# EAGLE design DC_UPS (EAGLE 5.06)
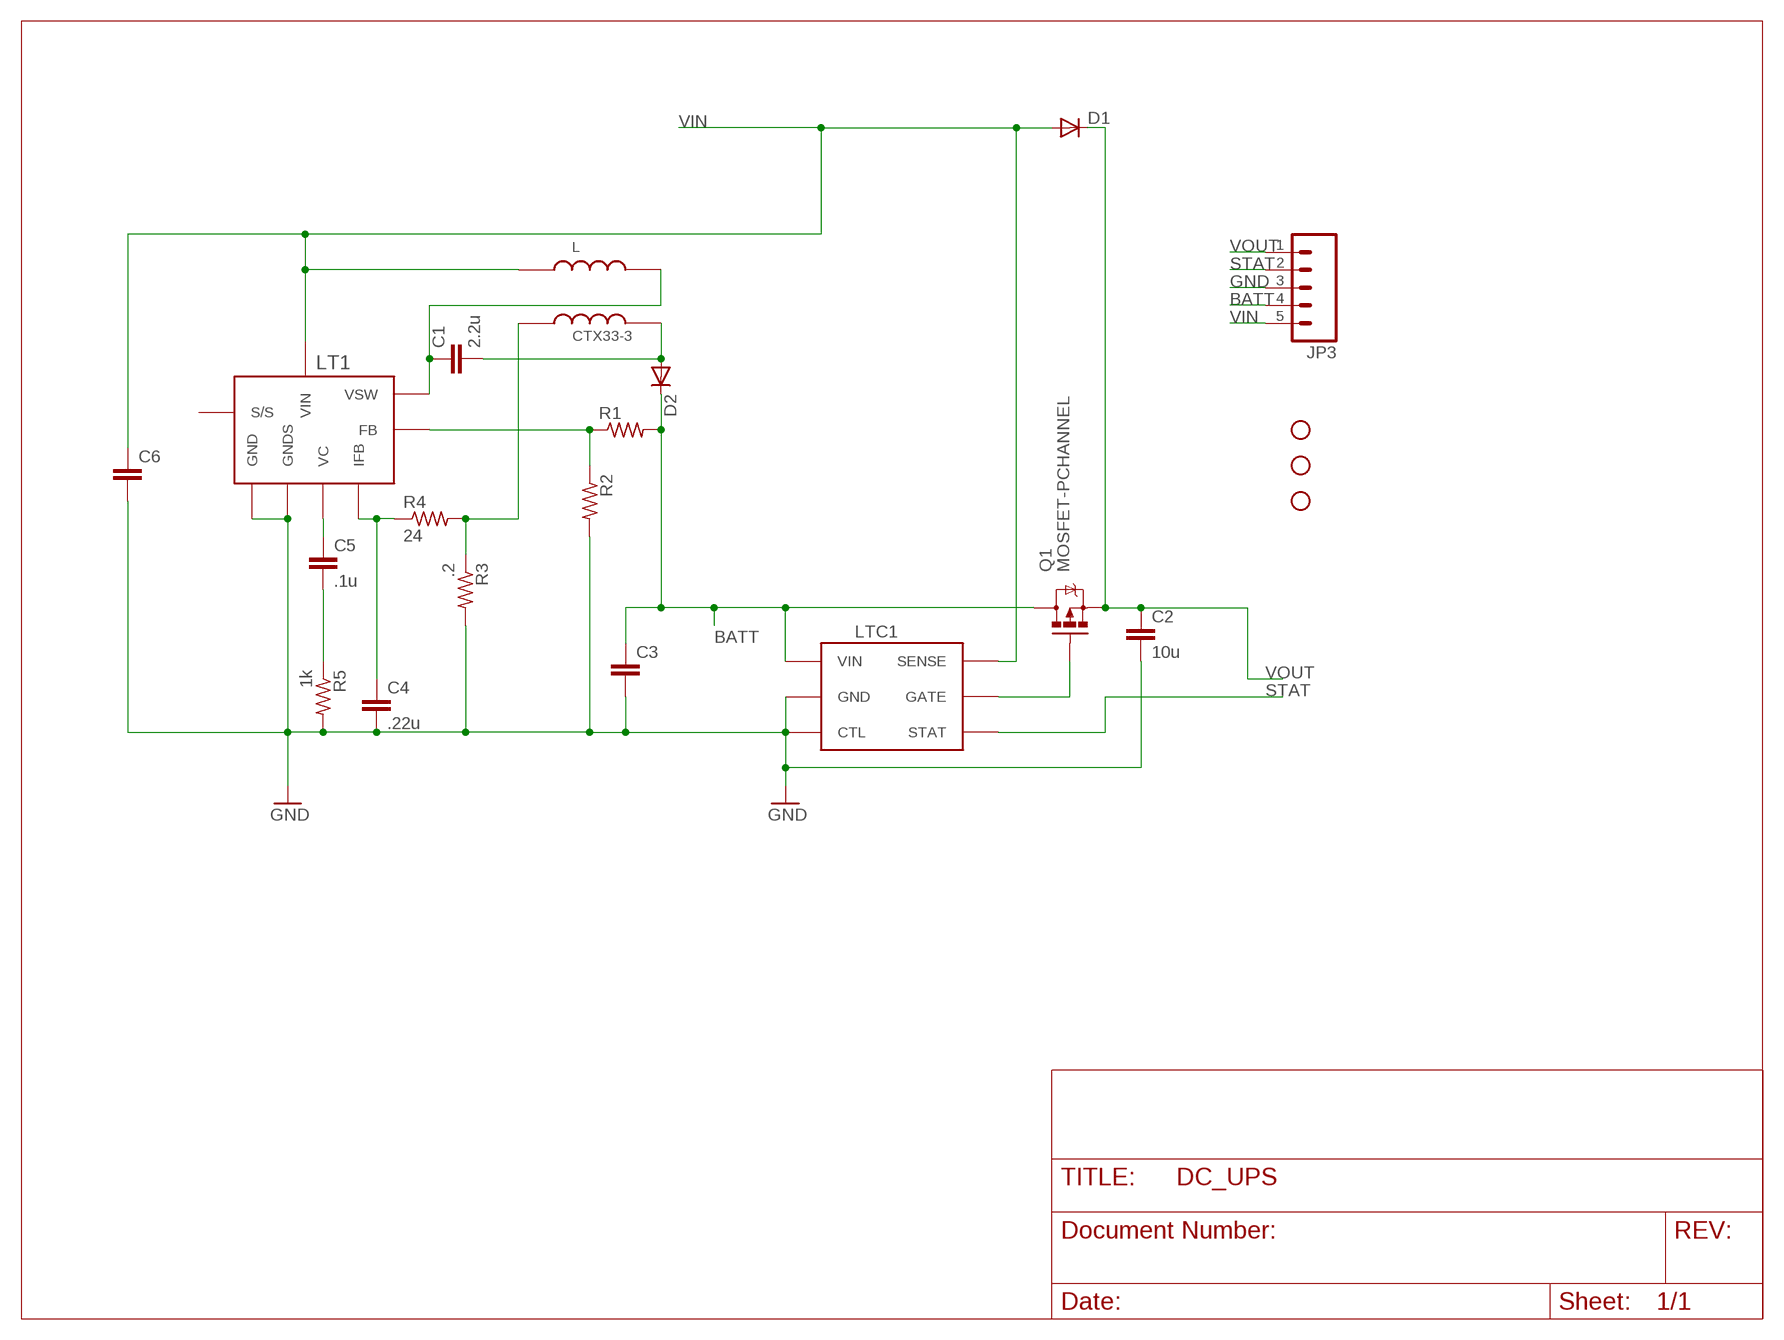
[diagram p0: schematic, sheet 1]

## Parts
C1  2.2u  CAP1206  [C1206]
C2  10u  CAP1210  [C1210]
C3  CAP1206  [C1206]
C4  .22u  CAP1206  [C1206]
C5  .1u  CAP1206  [C1206]
C6  CAP1206  [C1206]
D1  DIODESMA  [SMA-DIODE]
D2  DIODESMA  [SMA-DIODE]
JP1  STAND-OFF  [STAND-OFF]
JP2  STAND-OFF  [STAND-OFF]
JP3  M05PTH  [1X05]
JP4  STAND-OFF  [STAND-OFF]
L  CTX33-3  [CTX33-3]
LT1  LT1512  [SO08]
LTC1  LTC4412  [TSOT23-6]
Q1  MOSFET-PCHANNEL  [SOT23]
R1  R-US_R1206  [R1206]
R2  R-US_R1206  [R1206]
R3  .2  R-US_R1206  [R1206]
R4  24  R-US_R1206  [R1206]
R5  1k  R-US_R1206  [R1206]

## Nets
BATT: C3.1 D2.C JP3.4 LTC1.P$1(VIN) Q1.3(D) R1.2
GND: C2.2 C3.2 C4.2 C6.2 JP3.3 LT1.6(GNDS) LT1.7(GND) LTC1.P$2(GND) LTC1.P$3(CTL) R2.2 R3.2 R5.2
N$1: LTC1.P$5(GATE) Q1.1(G)
N$4: C1.1 L.P$3 LT1.8(VSW)
N$5: C5.1 LT1.1(VC)
N$6: C5.2 R5.1
N$7: C4.1 LT1.3(IFB) R4.1
N$8: L.P$2 R3.1 R4.2
N$9: C1.2 D2.A L.P$4
N$12: LT1.2(FB) R1.1 R2.1
STAT: JP3.2 LTC1.P$4(STAT)
VIN: C6.1 D1.A JP3.5 L.P$1 LT1.5(VIN) LTC1.P$6(SENSE)
VOUT: C2.1 D1.C JP3.1 Q1.2(S)
Unconnected: LT1.4(S/S)

## Library data of the parts
C1-C6 = _allyourbase:CAP: Capacitor Standard 0603 ceramic capacitor, and 0.1" leaded capacitor.
D1 D2 = _allyourbase:DIODE: Diode These are standard reverse protection diodes and small signal diodes. SMA package can handle up to about 1A. SOD-323 can handle about 200mA. What the SOD-323 package when ordering, there are some mfgs out there that are 5-pin packages.
JP1 JP2 JP4 = _allyourbase:STAND-OFF: Stand Off This is the mechanical footprint for a #4 phillips button head screw. Use the keepout ring to avoid running the screw head into surrounding components. SKU : PRT-00447
JP3 = _allyourbase:M05: Header 5 Standard 5-pin 0.1" header. Use with straight break away headers (SKU : PRT-00116), right angle break away headers (PRT-00553), swiss pins (PRT-00743), machine pins (PRT-00117), and female headers (PRT-00115). Molex polarized connector foot print use with SKU : PRT-08230 with associated crimp pins and housings.
L = _allyourbase:CTX33-3
LT1 = _allyourbase:LT1512
LTC1 = _allyourbase:LTC4412
Q1 = _allyourbase:MOSFET-PCHANNEL
R1-R5 = _allyourbase:R-US_: RESISTOR, American symbol

## Board
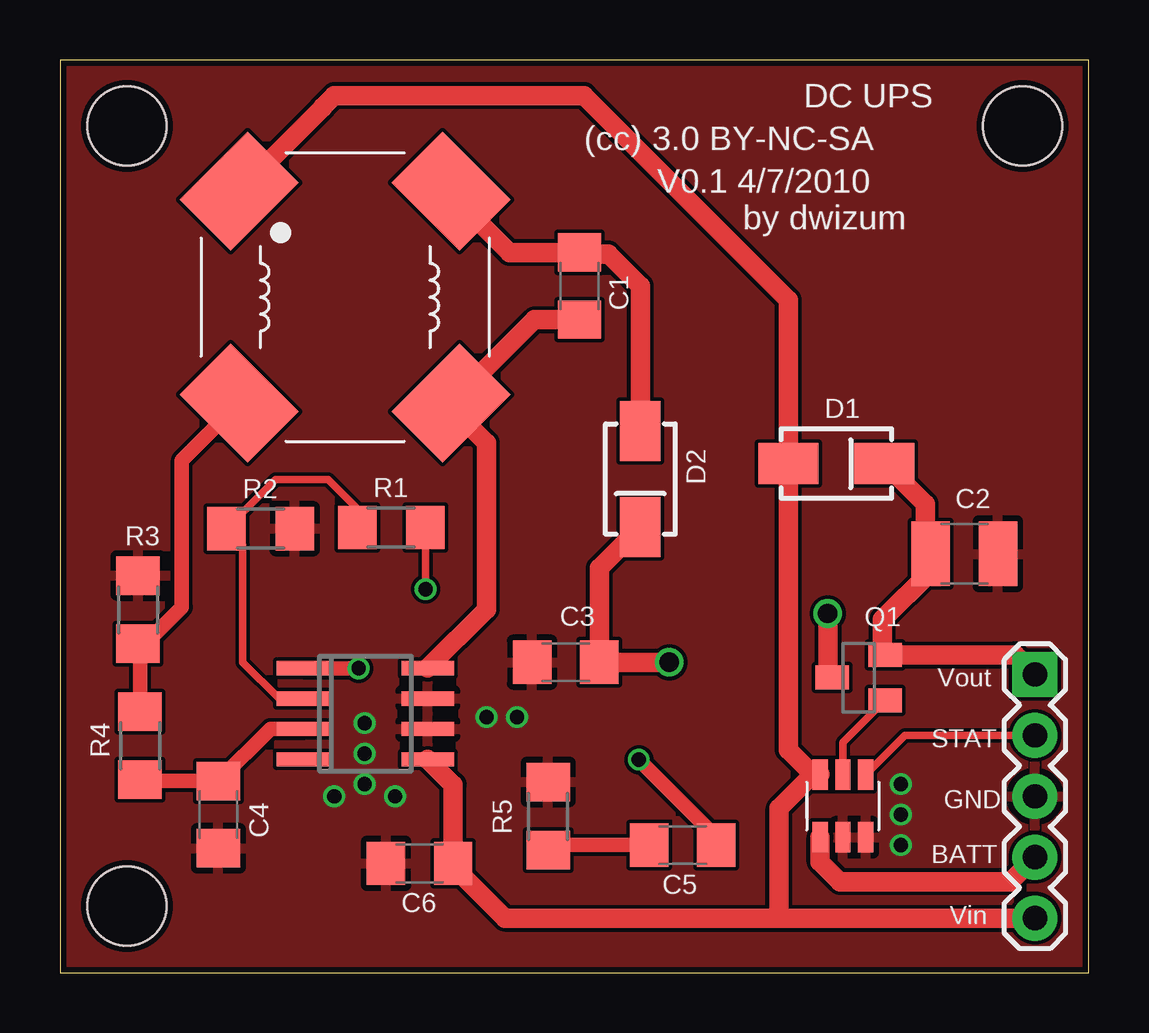
[diagram p1: board, top side]
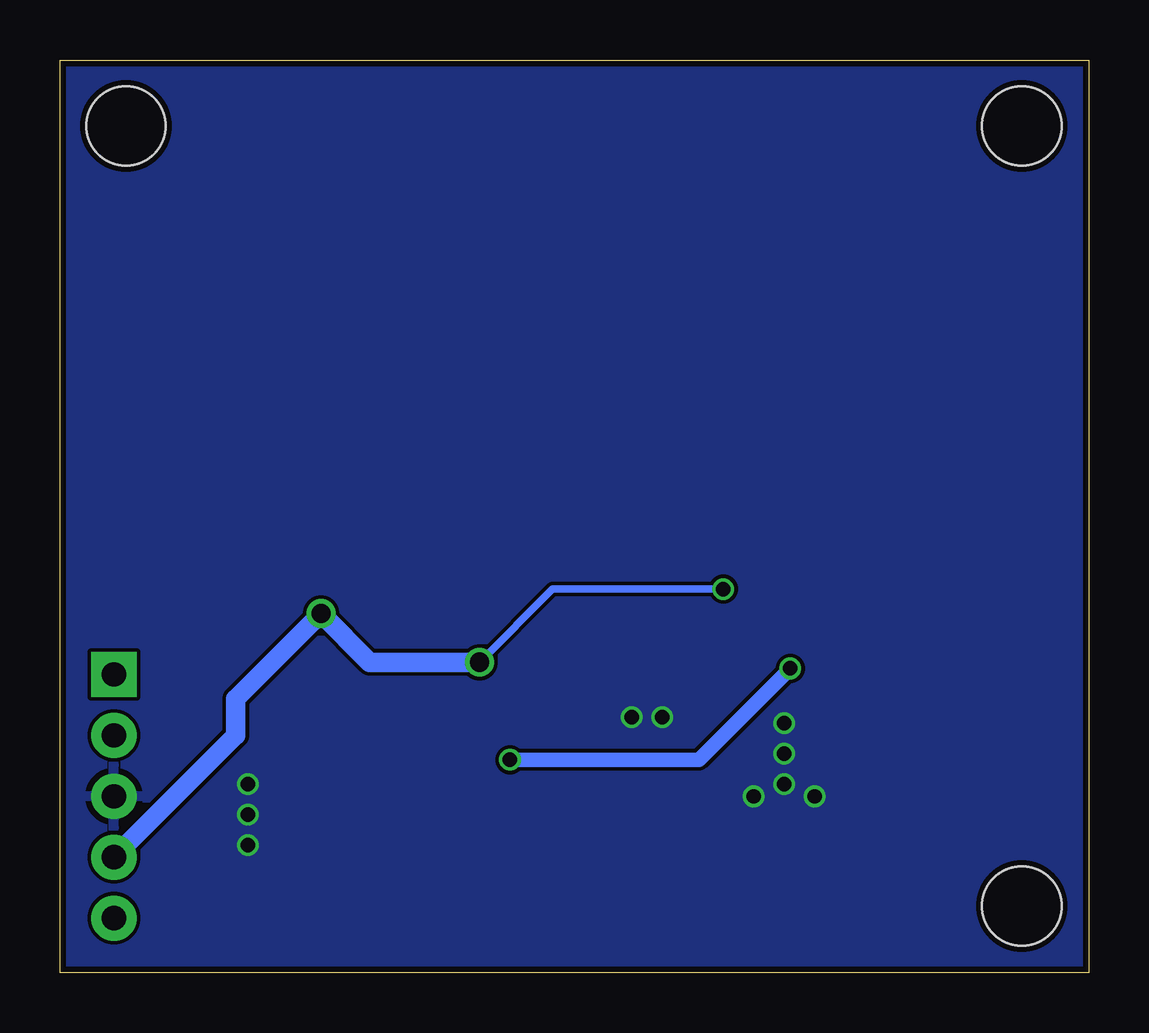
[diagram p2: board, bottom side, seen from below]

Size 42.89 x 38.06 mm. Coordinates in mm from the lower left corner, seen from the top.
Outline: 0,0 42.89,0 42.89,38.06 0,38.06 0,0
Copper layers (1*16): Top 0.035mm / dielectric 1.5mm / Bottom 0.035mm
Design rules "Fusion_eagle_rule_v1.1": minimum track width 6mil, minimum drill 12mil, track to track 6mil, track to pad 6mil, pad to pad 6mil, via to via 6mil, smd to smd 0mil, copper to edge 10mil, drill to drill 10mil, minimum pad ring 10mil, minimum via ring 6mil, stop-mask expansion 2mil, vias tented up to drill 100mil, thermal gap 10mil

### Footprints (pad centres in the part's own frame; a part is rotated, then mirrored left to right if it is on the bottom)
C1206 = smd 1.6 x 1.8: 1 -1.4,0; 2 1.4,0
C1210 = smd 1.6 x 2.7: 1 -1.4,0; 2 1.4,0
SMA-DIODE = smd 2.5 x 1.7: A -2,0; C 2,0
STAND-OFF = hole 3.302: 0,0
1X05 = drill 1.016 pad 1.88 square: 1 0,0 | drill 1.016 pad 1.88 round: 2 2.54,0; 3 5.08,0; 4 7.62,0; 5 10.16,0
CTX33-3 = smd 3 x 4: P$1 -6.25,0; P$3 6.25,0 | smd 4 x 3: P$2 0,-6.25; P$4 0,6.25
SO08 = smd 0.6 x 2.2: 1 -1.905,-2.6; 2 -0.635,-2.6; 3 0.635,-2.6; 4 1.905,-2.6; 5 1.905,2.6; 6 0.635,2.6; 7 -0.635,2.6; 8 -1.905,2.6
TSOT23-6 = smd 0.635 x 1.27: P$1 -0.95,-1.31; P$2 0,-1.31; P$3 0.95,-1.31; P$4 0.95,1.31; P$5 0,1.31; P$6 -0.95,1.31
SOT23 = smd 1 x 1.4: 1 -0.95,-1.1; 2 0.95,-1.1; 3 0,1.1
R1206 = smd 1.6 x 1.803: 1 -1.422,0; 2 1.422,0

### Placement (x,y rotation side)
C1  21.66,28.64 90 top
C2  37.7,17.48 0 top
C3  21.08,12.95 180 top
C4  6.6,6.6 270 top
C5  25.96,5.34 180 top
C6  14.99,4.57 180 top
D1  32.36,21.24 0 top
D2  24.19,20.59 270 top
JP1  2.79,35.31 0 top
JP2  40.13,35.31 0 top
JP3  40.64,12.45 270 top
JP4  2.79,2.79 0 top
L  11.89,28.17 315 top
LT1  12.73,10.81 270 top
LTC1  32.63,6.97 0 top
Q1  33.29,12.31 90 top
R1  13.81,18.57 0 top
R2  8.37,18.52 0 top
R3  3.25,15.14 90 top
R4  3.33,9.48 90 top
R5  20.35,6.54 90 top

### Tracks (layer width: path | path; a pad name or v marks a point on that pad's centre or on a via)
BATT  (via drill 0.6, 0.8)
  Top 0.305: R1.2 v15.23,16.01 v15.24,16
  Top 0.813: Q1.3 32,12.5 v32,14.99 | v25.4,12.95 C3.1 22.48,16.88 D2.C | JP3.4 39.62,3.81 32.51,3.81 31.68,4.64 LTC1.P$1
  Bottom 0.305: v15.24,16 22.35,16 v25.4,12.95
  Bottom 0.813: v25.4,12.95 29.97,12.95 v32,14.99 35.56,11.43 35.56,9.91 JP3.4
GND  (via drill 0.6)
  other vias: 12.7,10.41 12.7,9.14 12.7,7.87 35.05,7.87 35.05,6.6 35.05,5.33 11.43,7.37 13.97,7.37 17.78,10.67 19.05,10.67
  pour Bottom: 0,0 0,37.85 42.93,37.85 42.93,0
  pour Top: 0,0 0,37.85 42.93,37.85 42.93,0
N$1
  Top 0.305: LTC1.P$5 32.63,9.61 Q1.1
N$4
  Top 0.813: C1.1 19.79,27.24 L.P$3 16.31,23.57 17.78,22.1 17.78,15.16 LT1.8
N$5  (via drill 0.6)
  Top 0.61: C5.1 27.36,5.66 v24.13,8.89 | v12.45,12.7 10.14,12.7 LT1.1
  Bottom 0.61: v24.13,8.89 16.26,8.89 v12.45,12.7
N$6
  Top 0.61: C5.2 20.57,5.34 R5.1
N$7
  Top 0.61: LT1.3 8.78,10.18 C4.1 3.38,8 R4.1
N$8
  Top 0.61: R4.2 3.33,13.64 R3.1 3.56,13.72 5.08,15.24 5.08,21.37 L.P$2
N$9
  Top 0.813: D2.A 24.19,28.64 22.86,29.97 21.72,29.97 C1.2 18.73,30.04 15.75,33.02 15.88,33.02 L.P$4
N$12
  Top 0.305: LT1.2 9.13,11.45 7.62,12.95 7.62,17.85 R2.1 8.99,20.57 11.18,20.57 12.39,19.36 R1.1
STAT
  Top 0.305: JP3.2 35.21,9.91 LTC1.P$4
VIN
  Top 0.813: 30.23,2.29 18.54,2.29 16.39,4.44 C6.1 16.39,7.85 LT1.5 | 30.23,2.29 JP3.5 | 31.39,8.28 LTC1.P$6 | 31.39,8.28 29.97,6.86 29.97,2.54 30.23,2.29 | 31.39,8.28 30.36,9.31 D1.A 30.36,28.06 21.84,36.58 11.43,36.58 10.94,36.09 10.94,36.07 L.P$1
VOUT
  Top 0.813: JP3.1 39.82,13.26 Q1.2 34.29,13.37 34.29,14.73 36.3,16.74 C2.1 36.07,17.71 36.07,19.56 34.39,21.24 D1.C

### Text on the board
tPlace: DC UPS | (cc) 3.0 BY-NC-SA | V0.1 4/7/2010 | by dwizum | Vout | STAT | GND | BATT | Vin